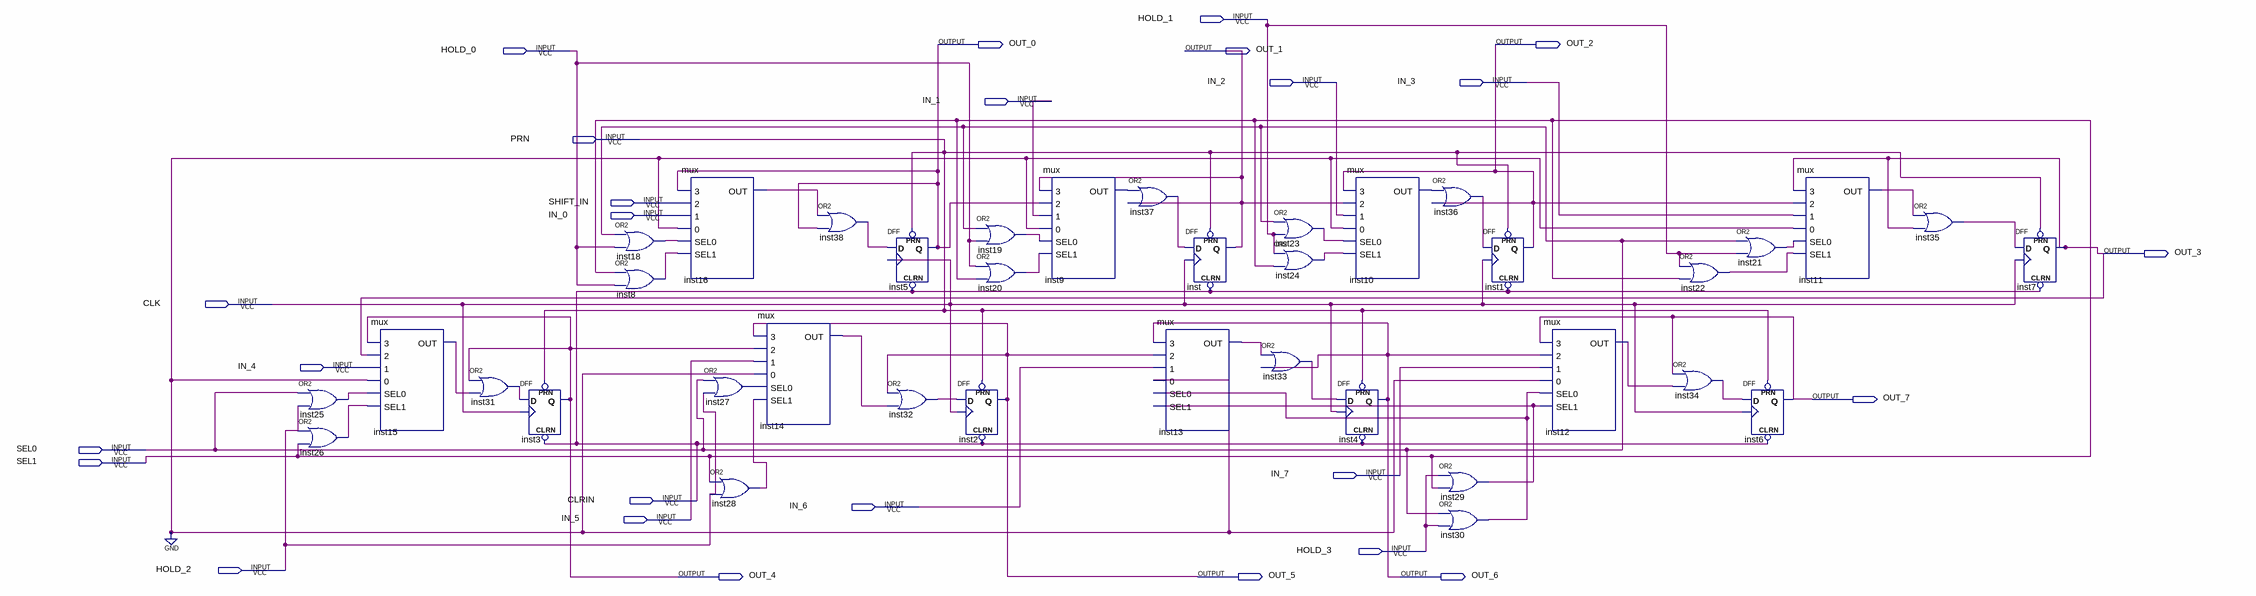
[diagram p0: schematic sheet]
// Quartus schematic 8b_reg.bdf as structural Verilog: 38 symbols, 26 pins
module \8b_reg  (
  input  HOLD_1,
  input  HOLD_0,
  input  IN_2,
  input  IN_3,
  input  IN_1,
  input  PRN,
  input  SHIFT_IN,
  input  IN_0,
  input  CLK,
  input  IN_4,
  input  SEL0,
  input  SEL1,
  input  IN_7,
  input  CLRIN,
  input  IN_6,
  input  IN_5,
  input  HOLD_3,
  input  HOLD_2,
  output OUT_0,
  output OUT_2,
  output OUT_1,
  output OUT_3,
  output OUT_7,
  output OUT_4,
  output OUT_5,
  output OUT_6
);

  wire inst8_out, inst9_out, inst10_out, inst11_out, inst12_out, inst13_out, inst14_out, inst15_out,
       inst16_out, inst18_out, inst19_out, inst20_out, inst21_out, inst22_out, inst23_out, inst24_out,
       inst25_out, inst26_out, inst27_out, inst28_out, inst29_out, inst30_out, inst31_out, inst32_out,
       inst33_out, inst34_out, inst35_out, inst36_out, inst37_out, inst38_out;

  or inst25 (inst25_out, SEL0, HOLD_2);
  or inst26 (inst26_out, HOLD_2, SEL1);
  mux inst15 (.\3 (OUT_4), .\2 (OUT_3), .\1 (IN_4), .\0 (1'b0), .SEL0(inst25_out), .SEL1(inst26_out), .OUT(inst15_out));
  or inst31 (inst31_out, OUT_4, inst15_out);
  DFF inst3 (.CLRN(CLRIN), .CLK(CLK), .D(inst31_out), .PRN(PRN), .Q(OUT_4));
  or inst18 (inst18_out, SEL0, HOLD_0);
  or inst8 (inst8_out, SEL1, HOLD_0);
  mux inst16 (
    .\3 (OUT_0), .\2 (SHIFT_IN), .\1 (IN_0), .\0 (1'b0), .SEL0(inst18_out), .SEL1(inst8_out), .OUT(inst16_out));
  or inst27 (inst27_out, SEL0, HOLD_2);
  or inst28 (inst28_out, SEL1, HOLD_2);
  mux inst14 (.\3 (OUT_5), .\2 (OUT_4), .\1 (IN_5), .\0 (1'b0), .SEL0(inst27_out), .SEL1(inst28_out), .OUT(inst14_out));
  or inst38 (inst38_out, inst16_out, OUT_0);
  DFF inst5 (.CLRN(CLRIN), .CLK(CLK), .D(inst38_out), .PRN(PRN), .Q(OUT_0));
  or inst32 (inst32_out, OUT_5, inst14_out);
  or inst19 (inst19_out, SEL0, HOLD_0);
  or inst20 (inst20_out, HOLD_0, SEL1);
  DFF inst2 (.CLRN(CLRIN), .CLK(CLK), .D(inst32_out), .PRN(PRN), .Q(OUT_5));
  mux inst9 (.\3 (OUT_1), .\2 (OUT_0), .\1 (IN_1), .\0 (1'b0), .SEL0(inst19_out), .SEL1(inst20_out), .OUT(inst9_out));
  or inst37 (inst37_out, inst9_out, OUT_1);
  DFF inst (.CLRN(CLRIN), .CLK(CLK), .D(inst37_out), .PRN(PRN), .Q(OUT_1));
  mux inst13 (.\3 (OUT_6), .\2 (OUT_5), .\1 (IN_6), .\0 (1'b0), .SEL0(inst30_out), .SEL1(inst29_out), .OUT(inst13_out));
  or inst23 (inst23_out, SEL0, HOLD_1);
  or inst24 (inst24_out, HOLD_1, SEL1);
  or inst33 (inst33_out, inst13_out, OUT_6);
  mux inst10 (.\3 (OUT_2), .\2 (OUT_1), .\1 (IN_2), .\0 (1'b0), .SEL0(inst23_out), .SEL1(inst24_out), .OUT(inst10_out));
  DFF inst4 (.CLRN(CLRIN), .CLK(CLK), .D(inst33_out), .PRN(PRN), .Q(OUT_6));
  or inst36 (inst36_out, inst10_out, OUT_2);
  or inst29 (inst29_out, HOLD_3, SEL1);
  or inst30 (inst30_out, SEL0, HOLD_3);
  DFF inst1 (.CLRN(CLRIN), .CLK(CLK), .D(inst36_out), .PRN(PRN), .Q(OUT_2));
  mux inst12 (.\3 (OUT_7), .\2 (OUT_6), .\1 (IN_7), .\0 (1'b0), .SEL0(inst30_out), .SEL1(inst29_out), .OUT(inst12_out));
  or inst22 (inst22_out, HOLD_1, SEL1);
  or inst34 (inst34_out, OUT_7, inst12_out);
  or inst21 (inst21_out, SEL0, HOLD_1);
  DFF inst6 (.CLRN(CLRIN), .CLK(CLK), .D(inst34_out), .PRN(PRN), .Q(OUT_7));
  mux inst11 (.\3 (OUT_3), .\2 (OUT_2), .\1 (IN_3), .\0 (1'b0), .SEL0(inst21_out), .SEL1(inst22_out), .OUT(inst11_out));
  or inst35 (inst35_out, inst11_out, OUT_3);
  DFF inst7 (.CLRN(CLRIN), .CLK(CLK), .D(inst35_out), .PRN(PRN), .Q(OUT_3));
endmodule
